# Altium schematic sheet 07-SYSTEM_PWR_DIST.SchDoc: Main power distribution
size A3; DrawnBy: Rain Adelbert; Revision: 1.2; SheetNumber: 7; SheetTotal: 9
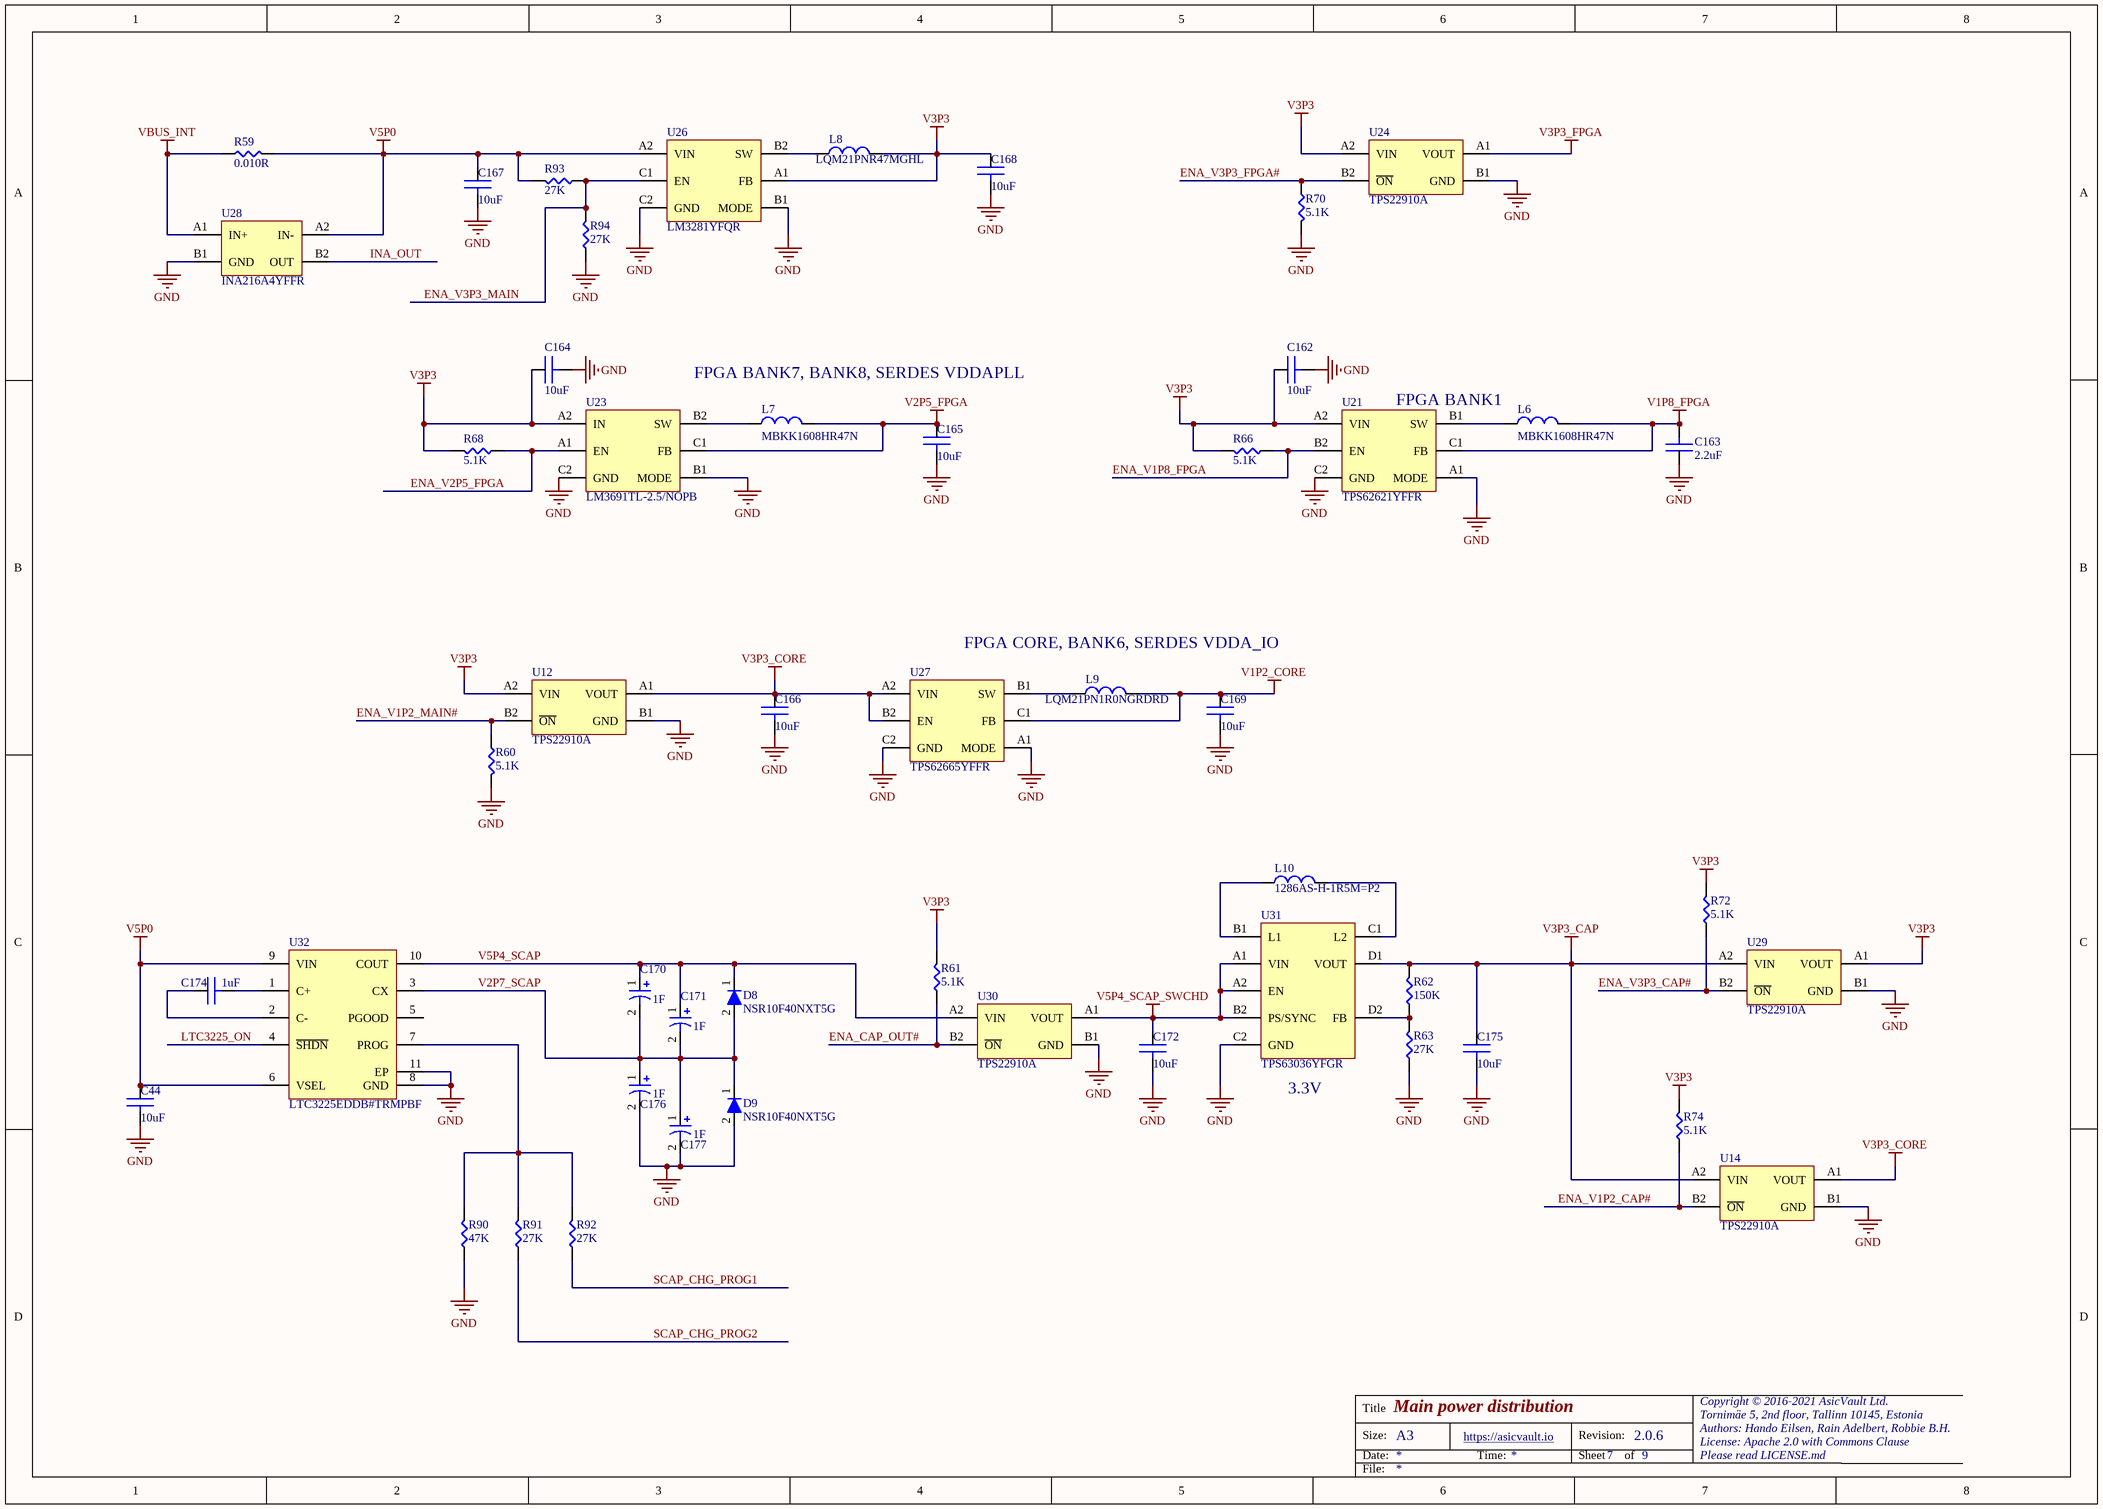
[diagram p0: 07-SYSTEM_PWR_DIST.SchDoc]

## Parts
C44  10uF  [C0402]
C162  10uF  [C0402]
C163  2.2uF  [C0201]
C164  10uF  [C0402]
C165  10uF  [C0402]
C166  10uF  [C0402]
C167  10uF  [C0402]
C168  10uF  [C0402]
C169  10uF  [C0402]
C170  1F  [RB-8*3.5]
C171  1F  [RB-8*3.5]
C172  10uF  [C0402]
C174  1uF  [C0201]
C175  10uF  [C0402]
C176  1F  [RB-8*3.5]
C177  1F  [RB-8*3.5]
D8  NSR10F40NXT5G  [0502]
D9  NSR10F40NXT5G  [0502]
L6  MBKK1608HR47N  [L0603]
L7  MBKK1608HR47N  [L0603]
L8  LQM21PNR47MGHL  [L0805]
L9  LQM21PN1R0NGRDRD  [L0805]
L10  1286AS-H-1R5M=P2  [DFE201612C]
R59  0.010R  [R0603]
R60  5.1K  [R0201]
R61  5.1K  [R0201]
R62  150K  [R0201]
R63  27K  [R0201]
R66  5.1K  [R0201]
R68  5.1K  [R0201]
R70  5.1K  [R0201]
R72  5.1K  [R0201]
R74  5.1K  [R0201]
R90  47K  [R0201]
R91  27K  [R0201]
R92  27K  [R0201]
R93  27K  [R0201]
R94  27K  [R0201]
U12  TPS22910A  [TPS22910A]
U14  TPS22910A  [TPS22910A]
U21  TPS62621YFFR  [DSBGA6]
U23  LM3691TL-2.5/NOPB  [DSBGA6]
U24  TPS22910A  [TPS22910A]
U26  LM3281YFQR  [DSBGA6]
U27  TPS62665YFFR  [DSBGA6]
U28  INA216A4YFFR  [DSBGA4]
U29  TPS22910A  [TPS22910A]
U30  TPS22910A  [TPS22910A]
U31  TPS63036YFGR  [DSBGA8]
U32  LTC3225EDDB#TRMPBF  [LT-DDB-10_V]

## Nets
GND: C44.2 C162.2 C163.1 C164.2 C165.2 C166.2 C167.2 C168.2 C169.2 C172.2 C175.2 C176.2 C177.2 D9.2(A) R60.2 R63.1 R70.2 R90.1 R94.1 U12.B1(GND) U14.B1(GND) U21.A1(MODE) U21.C2(GND) U23.B1(MODE) U23.C2(GND) U24.B1(GND) U26.B1(MODE) U26.C2(GND) U27.A1(MODE) U27.C2(GND) U28.B1(GND) U29.B1(GND) U30.B1(GND) U31.C2(GND) U32.8(GND) U32.11(EP)
V1P2_CORE: C169.1 L9.2 U27.C1(FB)
V1P8_FPGA: C163.2 L6.2 U21.C1(FB)
V2P5_FPGA: C165.1 L7.2 U23.C1(FB)
V3P3: C162.1 C164.1 C168.1 L8.2 R61.2 R66.2 R68.2 R72.2 R74.2 U12.A2(VIN) U21.A2(VIN) U23.A2(IN) U24.A2(VIN) U26.A1(FB) U29.A1(VOUT)
V3P3_CAP: C175.1 R62.2 U14.A2(VIN) U29.A2(VIN) U31.D1(VOUT)
V3P3_CORE: C166.1 U12.A1(VOUT) U14.A1(VOUT) U27.A2(VIN) U27.B2(EN)
V3P3_FPGA: U24.A1(VOUT)
V5P0: C44.1 C167.1 R59.2 R93.2 U26.A2(VIN) U28.A2(IN-) U32.6(VSEL) U32.9(VIN)
V5P4_SCAP_SWCHD: C172.1 U30.A1(VOUT) U31.A1(VIN) U31.A2(EN) U31.B2(PS/SYNC)
VBUS_INT: R59.1 U28.A1(IN+)
ENA_CAP_OUT#: R61.1 U30.B2(~{ON})
ENA_V1P2_CAP#: R74.1 U14.B2(~{ON})
ENA_V1P2_MAIN#: R60.1 U12.B2(~{ON})
ENA_V1P8_FPGA: R66.1 U21.B2(EN)
ENA_V2P5_FPGA: R68.1 U23.A1(EN)
ENA_V3P3_CAP#: R72.1 U29.B2(~{ON})
ENA_V3P3_FPGA#: R70.1 U24.B2(~{ON})
ENA_V3P3_MAIN: R93.1 R94.2 U26.C1(EN)
INA_OUT: U28.B2(OUT)
LTC3225_ON: U32.4(~{SHDN})
SCAP_CHG_PROG1: R92.1
SCAP_CHG_PROG2: R91.1
V2P7_SCAP: C170.2 C171.2 C176.1 C177.1 D8.2(A) D9.1(K) U32.3(CX)
V5P4_SCAP: C170.1 C171.1 D8.1(K) U30.A2(VIN) U32.10(COUT)
NetC174_1: C174.1 U32.2(C-)
NetC174_2: C174.2 U32.1(C+)
NetL6_1: L6.1 U21.B1(SW)
NetL7_1: L7.1 U23.B2(SW)
NetL8_1: L8.1 U26.B2(SW)
NetL9_1: L9.1 U27.B1(SW)
NetL10_1: L10.1 U31.B1(L1)
NetL10_2: L10.2 U31.C1(L2)
NetR62_1: R62.1 R63.2 U31.D2(FB)
NetR90_2: R90.2 R91.2 R92.2 U32.7(PROG)

Not connected (* = marked no-connect by the designer): U32 5(PGOOD)

## Notes on the sheet
- FPGA BANK7, BANK8, SERDES VDDAPLL
- (near U21) FPGA BANK1
- FPGA CORE, BANK6, SERDES VDDA_IO
- (near U31) 3.3V
- Title
- Size:
- Date:
- A3
- https://asicvault.io
- Time:
- Revision:
- Sheet
- of
- 2.0.6
- Copyright © 2016-2021 AsicVault Ltd.
- Tornimäe 5, 2nd floor, Tallinn 10145, Estonia
- Authors: Hando Eilsen, Rain Adelbert, Robbie B.H.
- License: Apache 2.0 with Commons Clause
- Please read LICENSE.md
- File:

## Library data of the parts
C44 C162 C164-C169 C172 C175 = 10uF/0402: Description 1: Multilayer Ceramic Capacitors MLCC - SMD/SMT 10uF 20% 6.3 Volts 0402; Supplier Part Number 1: 791-0402X106M6R3CT; Supplier 1: Mouser
C163 = 2.2uF/0201: Description 1: CAP CER 2.2UF 6.3V X5R 0201; Supplier 1: Digi-Key; Supplier Part Number 1: 490-13224-1-ND
C170 C171 C176 C177 = 1F: Description 1: CAP ALUM 100UF 35V 20% SMD; Supplier 1: Digi-Key; Supplier Part Number 1: 1189-1620-1-ND
C174 = 1uF/0201/CC0201KRX7R7BB103: Description 1: CAP CER 1UF 6.3V X5R 0201; Supplier 1: Digi-Key; Supplier Part Number 1: 311-1613-1-ND
D8 D9 = NSR10F40NXT5G: Description 1: DIODE SCHOTTKY 40V 1A 2DSN; Supplier 1: Digi-Key; Supplier Part Number 1: NSR10F40NXT5GOSCT-ND
L6 L7 = 0.47uH/MBKK1608HR47N: Description 1: 0.47uH, 104mohm, 1.1A. 0805; Supplier 1: Mouser; Supplier Part Number 1: 963-MBKK1608HR47N
L8 = 0.47uH/LQM21PNR47MGHL: Description 1: 0.47uH, 40mohm, 2.4A. 0805; Supplier 1: Mouser; Supplier Part Number 1: 81-LQM21PNR47MGHL
L9 = 1uH/LQM21PN1R0NGRDRD: Description 1: 1uH, 66mohm, 1.3A. 0805; Supplier 1: Mouser; Supplier Part Number 1: 81-LQM21PN1R0NGRDRD
L10 = 1.5uH/1286AS-H-1R5M=P2: Description 1: FIXED IND 1.5UH 2A 114 MOHM SMD; Supplier 1: Digi-Key; Supplier Part Number 1: 490-10604-1-ND
R59 = 0.010R/0603: Description 1: RES SMD 0.010 OHM 1% 1/4W 0603; Supplier 1: Mouser; Supplier Part Number 1: 755-PMR03EZPFU10L0
R60 R61 R66 R68 R70 R72 R74 = 5.1K/1%/0201: Description 1: RES SMD 5.1K OHM 1% 1/20W 0201; Supplier 1: Digi-Key; Supplier Part Number 1: YAG2741CT-ND
R62 = 150K/1%/0201: Description 1: RES SMD 150K OHM 1% 1/20W 0201; Supplier 1: Digi-Key; Supplier Part Number 1: YAG2272CT-ND
R63 R91-R94 = 27K/1%/0201: Description 1: RES SMD 27K OHM 1% 1/20W 0201; Supplier 1: Digi-Key; Supplier Part Number 1: P27.0KABCT-ND
R90 = 47K/1%/0201: Description 1: RES SMD 47K OHM 1% 1/20W 0201; Supplier 1: Digi-Key; Supplier Part Number 1: 311-47KMCT-ND
U12 U14 U24 U29 U30 = TPS22910A: Description 1: IC LOAD SWITCH 2A 4DSBAGA; Supplier 1: Digi-Key; Supplier Part Number 1: 296-29860-1-ND
U21 = TPS62621YFFR: Description 1: IC REG BCK 1.8V 0.6A SYNC 6DSBGA; Supplier 1: Digi-Key; Supplier Part Number 1: 296-24880-1-ND
U23 = LM3691TL-2.5/NOPB: Description 1: IC REG BUCK 2.5V 1A SYNC 6USMD; Supplier 1: Digi-Key; Supplier Part Number 1: LM3691TL-2.5/NOPBCT-ND
U26 = LM3281YFQR: Description 1: IC REG BCK 3.3V 1.2A SYNC 6DSBGA; Supplier 1: Digi-Key; Supplier Part Number 1: 296-40185-6-ND
U27 = TPS62665YFFR: Description 1: IC REG BUCK 1.2V 1A SYNC 6DSBGA; Supplier 1: Digi-Key; Supplier Part Number 1: 296-27852-1-ND
U28 = INA216A4YFFR: Description 1: IC CURRENT SHUNT MONITOR 4DSBGA; Supplier 1: Digi-Key; Supplier Part Number 1: 296-28104-1-ND
U31 = TPS63036YFGR: Description 1: IC REG BCK BST ADJ 1A SYNC 8WCSP; Supplier 1: Digi-Key; Supplier Part Number 1: 296-34935-1-ND
U32 = LTC3225EDDB#TRMPBF: Description 1: IC SUPERCAP CHARGER 150MA 10DFN; Supplier 1: Digi-Key; Supplier Part Number 1: LTC3225EDDB#TRMPBFCT-ND